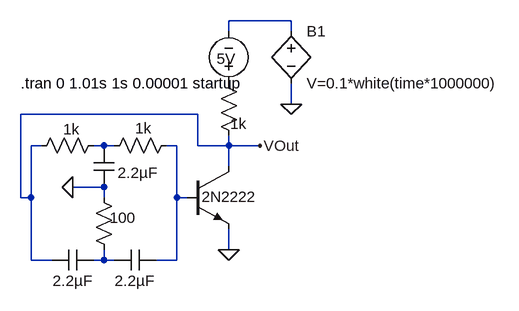
[diagram p0: schematic PhaseShiftOsc.asc]
PhaseShiftOsc.asc, the LTspice schematic file:
Version 4
SHEET 1 880 680
WIRE 176 -16 80 -16
WIRE 80 0 80 -16
WIRE 176 0 176 -16
WIRE 176 112 176 80
WIRE 32 128 -240 128
WIRE -208 176 -224 176
WIRE -112 176 -128 176
WIRE -96 176 -112 176
WIRE 0 176 -16 176
WIRE 32 176 32 128
WIRE 80 176 80 160
WIRE 80 176 32 176
WIRE 128 176 80 176
WIRE 80 208 80 176
WIRE -112 240 -160 240
WIRE -240 256 -240 128
WIRE -224 256 -224 176
WIRE -224 256 -240 256
WIRE -112 256 -112 240
WIRE 0 256 0 176
WIRE 16 256 0 256
WIRE 80 336 80 304
WIRE -224 352 -224 256
WIRE -192 352 -224 352
WIRE -112 352 -112 336
WIRE -112 352 -128 352
WIRE -96 352 -112 352
WIRE 0 352 0 256
WIRE 0 352 -32 352
FLAG 80 336 0
FLAG -160 240 0
FLAG 128 176 VOut
FLAG 176 112 0
SYMBOL npn 16 208 R0
WINDOW 0 56 32 Invisible 2
WINDOW 3 22 47 Left 2
SYMATTR InstName Q1
SYMATTR Value 2N2222
SYMBOL voltage 80 96 R180
WINDOW 0 -64 64 Invisible 2
WINDOW 3 -11 54 Left 2
WINDOW 123 0 0 Left 2
WINDOW 39 0 0 Left 2
SYMATTR InstName V1
SYMATTR Value 5V
SYMBOL res 64 64 R0
WINDOW 0 36 40 Invisible 2
WINDOW 3 18 78 Left 2
SYMATTR InstName R1
SYMATTR Value 1k
SYMBOL res 0 160 R90
WINDOW 0 0 56 Invisible 2
WINDOW 3 -26 51 VTop 2
SYMATTR InstName R2
SYMATTR Value 1k
SYMBOL res -112 160 R90
WINDOW 0 0 56 Invisible 2
WINDOW 3 -25 50 VTop 2
SYMATTR InstName R3
SYMATTR Value 1k
SYMBOL cap -128 176 R0
WINDOW 0 24 8 Invisible 2
WINDOW 3 37 42 Left 2
SYMATTR InstName C1
SYMATTR Value 2.2µF
SYMBOL cap -32 336 R90
WINDOW 0 0 32 Invisible 2
WINDOW 3 32 32 VTop 2
SYMATTR InstName C2
SYMATTR Value 2.2µF
SYMBOL cap -128 336 R90
WINDOW 0 0 32 Invisible 2
WINDOW 3 32 32 VTop 2
SYMATTR InstName C3
SYMATTR Value 2.2µF
SYMBOL res -128 240 R0
WINDOW 0 36 40 Invisible 2
WINDOW 3 25 47 Left 2
SYMATTR InstName R4
SYMATTR Value 100
SYMBOL bv 176 -16 R0
SYMATTR InstName B1
SYMATTR Value V=0.1*white(time*1000000)
TEXT -240 80 Left 2 !.tran 0 1.01s 1s 0.00001 startup

The netlist it stands for:
* PhaseShiftOsc.asc
Q1 VOut N003 0 0 2N2222
V1 P001 N001 5V
R1 P001 VOut 1k
R2 N003 N002 1k
R3 N002 VOut 1k
C1 N002 0 2.2µF
C2 N003 N004 2.2µF
C3 N004 VOut 2.2µF
R4 0 N004 100
B1 N001 0 V=0.1*white(time*1000000)
.model NPN NPN
.model PNP PNP
.lib standard.bjt
.tran 0 1.01s 1s 0.00001 startup
.backanno
.end